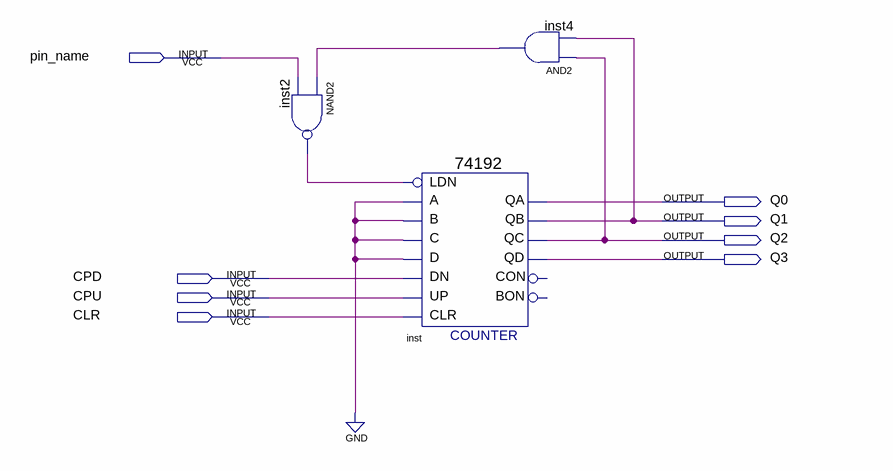
[diagram p0: schematic sheet]
// Quartus schematic Block1.bdf as structural Verilog: 3 symbols, 8 pins
module Block1 (
  input  pin_name,
  input  CPD,
  input  CPU,
  input  CLR,
  output Q0,
  output Q1,
  output Q2,
  output Q3
);

  wire inst2_out, inst4_out;

  nand inst2 (inst2_out, inst4_out, pin_name);
  \74192  inst (
    .D(1'b0), .C(1'b0), .A(1'b0), .B(1'b0), .CLR(CLR), .UP(CPU), .DN(CPD), .LDN(inst2_out), .QB(Q1), .QA(Q0),
    .QC(Q2), .QD(Q3));  // open: BON, CON
  and inst4 (inst4_out, Q2, Q1);
endmodule
